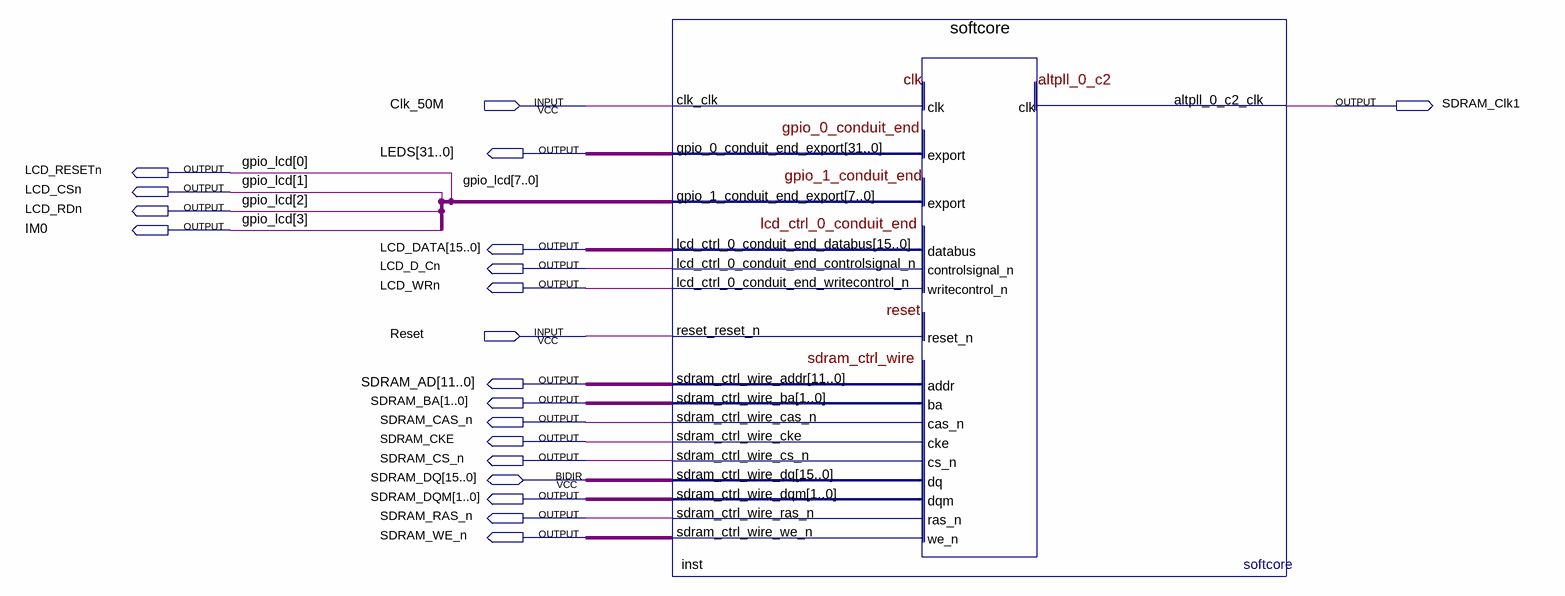
[diagram p0: schematic sheet]
// Quartus schematic main_project.bdf as structural Verilog: 1 symbols, 20 pins
module main_project (
  input  Clk_50M,
  input  Reset,
  inout  [15:0] SDRAM_DQ,
  output SDRAM_Clk1,
  output [31:0] LEDS,
  output LCD_RESETn,
  output LCD_CSn,
  output LCD_RDn,
  output IM0,
  output [15:0] LCD_DATA,
  output LCD_D_Cn,
  output LCD_WRn,
  output [11:0] SDRAM_AD,
  output [1:0] SDRAM_BA,
  output SDRAM_CAS_n,
  output SDRAM_CKE,
  output SDRAM_CS_n,
  output [1:0] SDRAM_DQM,
  output SDRAM_RAS_n,
  output SDRAM_WE_n
);

  wire [7:4] gpio_lcd;

  softcore inst (
    .clk_clk(Clk_50M), .reset_reset_n(Reset), .altpll_0_c2_clk(SDRAM_Clk1),
    .lcd_ctrl_0_conduit_end_databus(LCD_DATA), .lcd_ctrl_0_conduit_end_controlsignal_n(LCD_D_Cn),
    .lcd_ctrl_0_conduit_end_writecontrol_n(LCD_WRn), .sdram_ctrl_wire_addr(SDRAM_AD),
    .sdram_ctrl_wire_ba(SDRAM_BA), .sdram_ctrl_wire_cas_n(SDRAM_CAS_n), .sdram_ctrl_wire_cke(SDRAM_CKE),
    .sdram_ctrl_wire_cs_n(SDRAM_CS_n), .sdram_ctrl_wire_dqm(SDRAM_DQM), .sdram_ctrl_wire_ras_n(SDRAM_RAS_n),
    .sdram_ctrl_wire_we_n(SDRAM_WE_n), .gpio_0_conduit_end_export(LEDS),
    .gpio_1_conduit_end_export({gpio_lcd, IM0, LCD_RDn, LCD_CSn, LCD_RESETn}), .sdram_ctrl_wire_dq(SDRAM_DQ));

  // Other names for the same wires on the sheet: gpio_lcd[3:0] = {IM0, LCD_RDn, LCD_CSn, LCD_RESETn}
endmodule
